# Altium schematic sheet comm_connector.SchDoc
size A; DocumentNumber: 2; SheetNumber: 2; SheetTotal: 2
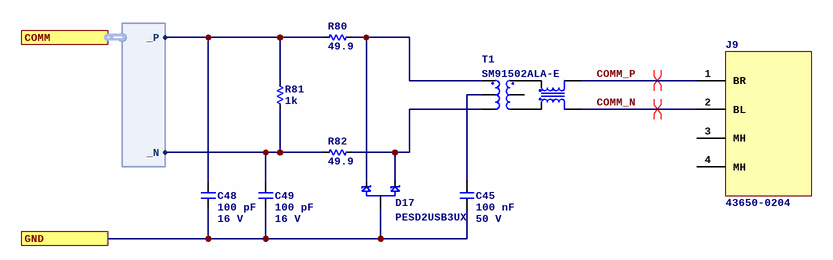
[diagram p0: comm_connector.SchDoc]

## Parts
C45  Capacitance: 100 nF  Voltage Rating: 50 V  [C0402]  (hidden comment: CL05B104KB54PNC)
C48  Capacitance: 100 pF  Voltage Rating: 16 V  [C0402]  (hidden comment: 0402YA101JAT2A)
C49  Capacitance: 100 pF  Voltage Rating: 16 V  [C0402]  (hidden comment: 0402YA101JAT2A)
D17  PESD2USB3UX  [3SOT23]
J9  43650-0204  [MOLEX_MICROFIT_0436500204]
R80  value 49.9  [R0402]  (hidden comment: 0402WGF499JTCE)
R81  value 1k  [R0603]  (hidden comment: HP03W5F1001T5E)
R82  value 49.9  [R0402]  (hidden comment: 0402WGF499JTCE)
T1  SM91502ALA-E  [BOURNS_SM91502]

## Ports
COMM (harness DIFF), GND

## Harnesses
DIFF: _P, _N

## Nets
COMM_N: J9.2(BL) T1.4
COMM_P: J9.1(BR) T1.6
GND: C45.2 C48.2 C49.2 D17.3 ; port GND
NetC45_1: C45.1 T1.2
NetC48_1: C48.1 R80.1 R81.2 ; port COMM._P
NetC49_1: C49.1 R81.1 R82.1 ; port COMM._N
NetD17_1: D17.1 R82.2 T1.3
NetD17_2: D17.2 R80.2 T1.1

Not connected (* = marked no-connect by the designer): J9 3(MH) 4(MH); T1 5

## Layout directives
differential pair; differential pair class DE_100: COMM_N, COMM_P

## Library data of the parts
C45 = CL05B104KB54PNC: Manufacturer: Samsung Electro-Mechanics; Dielectric: X7R; ComponentLink1URL: https://wmsc.lcsc.com/wmsc/upload/file/pdf/v2/lcsc/2304140030_Samsung-Electro-Mechanics-CL05B104KB54PNC_C307331.pdf; ComponentLink1Description: Datasheet; Manufacturer Part Number: CL05B104KB54PNC; Package: 0402; Supplier 2: LCSC; Supplier Part Number 2: C307331
C48 C49 = 0402YA101JAT2A: Manufacturer: Kyocera AVX; Dielectric: C0G; Manufacturer Part Number: 0402YA101JAT2A; ComponentLink1URL: https://datasheet.lcsc.com/lcsc/2304140030_Kyocera-AVX-0402YA101JAT2A_C2174471.pdf; ComponentLink1Description: Datasheet; Package: 0402; Supplier 2: LCSC; Supplier Part Number 2: C2174471
D17 = PESD2USB3UX: DIODE ESD USB SOT-23; Manufacturer: Nexperia USA Inc.; Polarity: Unidirectional; Capacitance (pF): 0.7; Standoff (V): 3.3; Min Breakdown Voltage: 4.2 V; Supplier 1: DigiKey; Supplier Part Number 1: 1727-PESD2USB3UX-CT-ND; Manufacturer Part Number: PESD2USB3UX; Supplier 2: LCSC; Supplier Part Number 2: C3708426; ComponentLink1Description: Datasheet; ComponentLink1URL: https://assets.nexperia.com/documents/data-sheet/PESD2USB3UX-T.pdf; Supplier 3: Mouser; Supplier Part Number 3: 771-PESD2USB3UX-TR
J9 = 43650-0204: Rectangular Power Connector, 2 Contact(s), Male, Solder Terminal, Receptacle; Manufacturer: Molex; Manufacturer Part Number: 43650-0204; ComponentLink1Description: Product page; ComponentLink1URL: https://www.molex.com/en-us/products/part-detail/436500204; ComponentLink2Description: Drawing; ComponentLink2URL: https://www.molex.com/content/dam/molex/molex-dot-com/products/automated/en-us/salesdrawingpdf/436/43650/436500204_sd.pdf; Supplier 1: DigiKey; Supplier Part Number 1: WM1875-ND; Supplier 2: LCSC; Supplier Part Number 2: C587652; Supplier 3: Mouser; Supplier Part Number 3: 538-43650-0204
R80 R82 = 0402WGF499JTCE: Manufacturer: UNI-ROYAL(Uniroyal Elec); Tolerance: 1%; Temperature Coefficient: Â±100ppm/â„ƒ; Power Rating (mW): 62.5; Manufacturer Part Number: 0402WGF499JTCE; ComponentLink1Description: Datasheet; ComponentLink1URL: https://wmsc.lcsc.com/wmsc/upload/file/pdf/v2/lcsc/2205311900_UNI-ROYAL-Uniroyal-Elec-0402WGF499JTCE_C25120.pdf; Package: 0402; Supplier 2: LCSC; Supplier Part Number 2: C25120
R81 = HP03W5F1001T5E: Manufacturer: UNI-ROYAL(Uniroyal Elec); Tolerance: 1%; Temperature Coefficient: Â±100ppm/â„ƒ; Power Rating (mW): 200; Manufacturer Part Number: HP03W5F1001T5E; ComponentLink1Description: Datasheet; ComponentLink1URL: https://wmsc.lcsc.com/wmsc/upload/file/pdf/v2/lcsc/2304140030_UNI-ROYAL-Uniroyal-Elec-HP03W5F1001T5E_C2759450.pdf; Package: 0603; Supplier 2: LCSC; Supplier Part Number 2: C2759450
T1 = SM91502ALA-E: 200ÂµH LAN Pulse Transformer 1CT:1CT Surface Mount; Manufacturer: Bourns Inc.; Supplier 1: DigiKey; Manufacturer Part Number: SM91502ALA-E; ComponentLink1URL: https://www.bourns.com/docs/product-datasheets/sm91502ala.pdf; ComponentLink1Description: Datasheet; Supplier Part Number 1: 118-SM91502ALA-ECT-ND; Supplier 2: LCSC; Supplier Part Number 2: C5337144; Supplier 3: Mouser; Supplier Part Number 3: 652-SM91502ALA-E